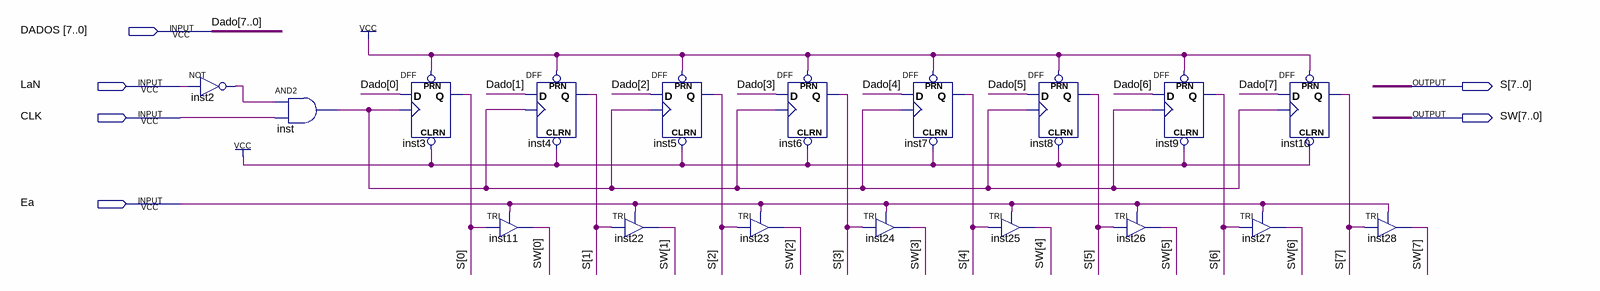
[diagram p0: schematic sheet]
// Quartus schematic Acumulador.bdf as structural Verilog: 18 symbols, 6 pins
module Acumulador (
  input  [7:0] DADOS,
  input  LaN,
  input  CLK,
  input  Ea,
  output [7:0] S,
  output [7:0] SW
);

  wire inst2_out, inst_out;

  not inst2 (inst2_out, LaN);
  and inst (inst_out, inst2_out, CLK);
  DFF inst3 (.CLRN(1'b1), .CLK(inst_out), .D(DADOS[0]), .PRN(1'b1), .Q(S[0]));
  TRI inst11 (.IN(S[0]), .OE(Ea), .OUT(SW[0]));
  DFF inst4 (.CLRN(1'b1), .CLK(inst_out), .D(DADOS[1]), .PRN(1'b1), .Q(S[1]));
  TRI inst22 (.IN(S[1]), .OE(Ea), .OUT(SW[1]));
  DFF inst5 (.CLRN(1'b1), .CLK(inst_out), .D(DADOS[2]), .PRN(1'b1), .Q(S[2]));
  TRI inst23 (.IN(S[2]), .OE(Ea), .OUT(SW[2]));
  DFF inst6 (.CLRN(1'b1), .CLK(inst_out), .D(DADOS[3]), .PRN(1'b1), .Q(S[3]));
  TRI inst24 (.IN(S[3]), .OE(Ea), .OUT(SW[3]));
  DFF inst7 (.CLRN(1'b1), .CLK(inst_out), .D(DADOS[4]), .PRN(1'b1), .Q(S[4]));
  TRI inst25 (.IN(S[4]), .OE(Ea), .OUT(SW[4]));
  DFF inst8 (.CLRN(1'b1), .CLK(inst_out), .D(DADOS[5]), .PRN(1'b1), .Q(S[5]));
  TRI inst26 (.IN(S[5]), .OE(Ea), .OUT(SW[5]));
  DFF inst9 (.CLRN(1'b1), .CLK(inst_out), .D(DADOS[6]), .PRN(1'b1), .Q(S[6]));
  TRI inst27 (.IN(S[6]), .OE(Ea), .OUT(SW[6]));
  DFF inst10 (.CLRN(1'b1), .CLK(inst_out), .D(DADOS[7]), .PRN(1'b1), .Q(S[7]));
  TRI inst28 (.IN(S[7]), .OE(Ea), .OUT(SW[7]));

  // Other names for the same wires on the sheet: Dado[7:0] = DADOS
endmodule
